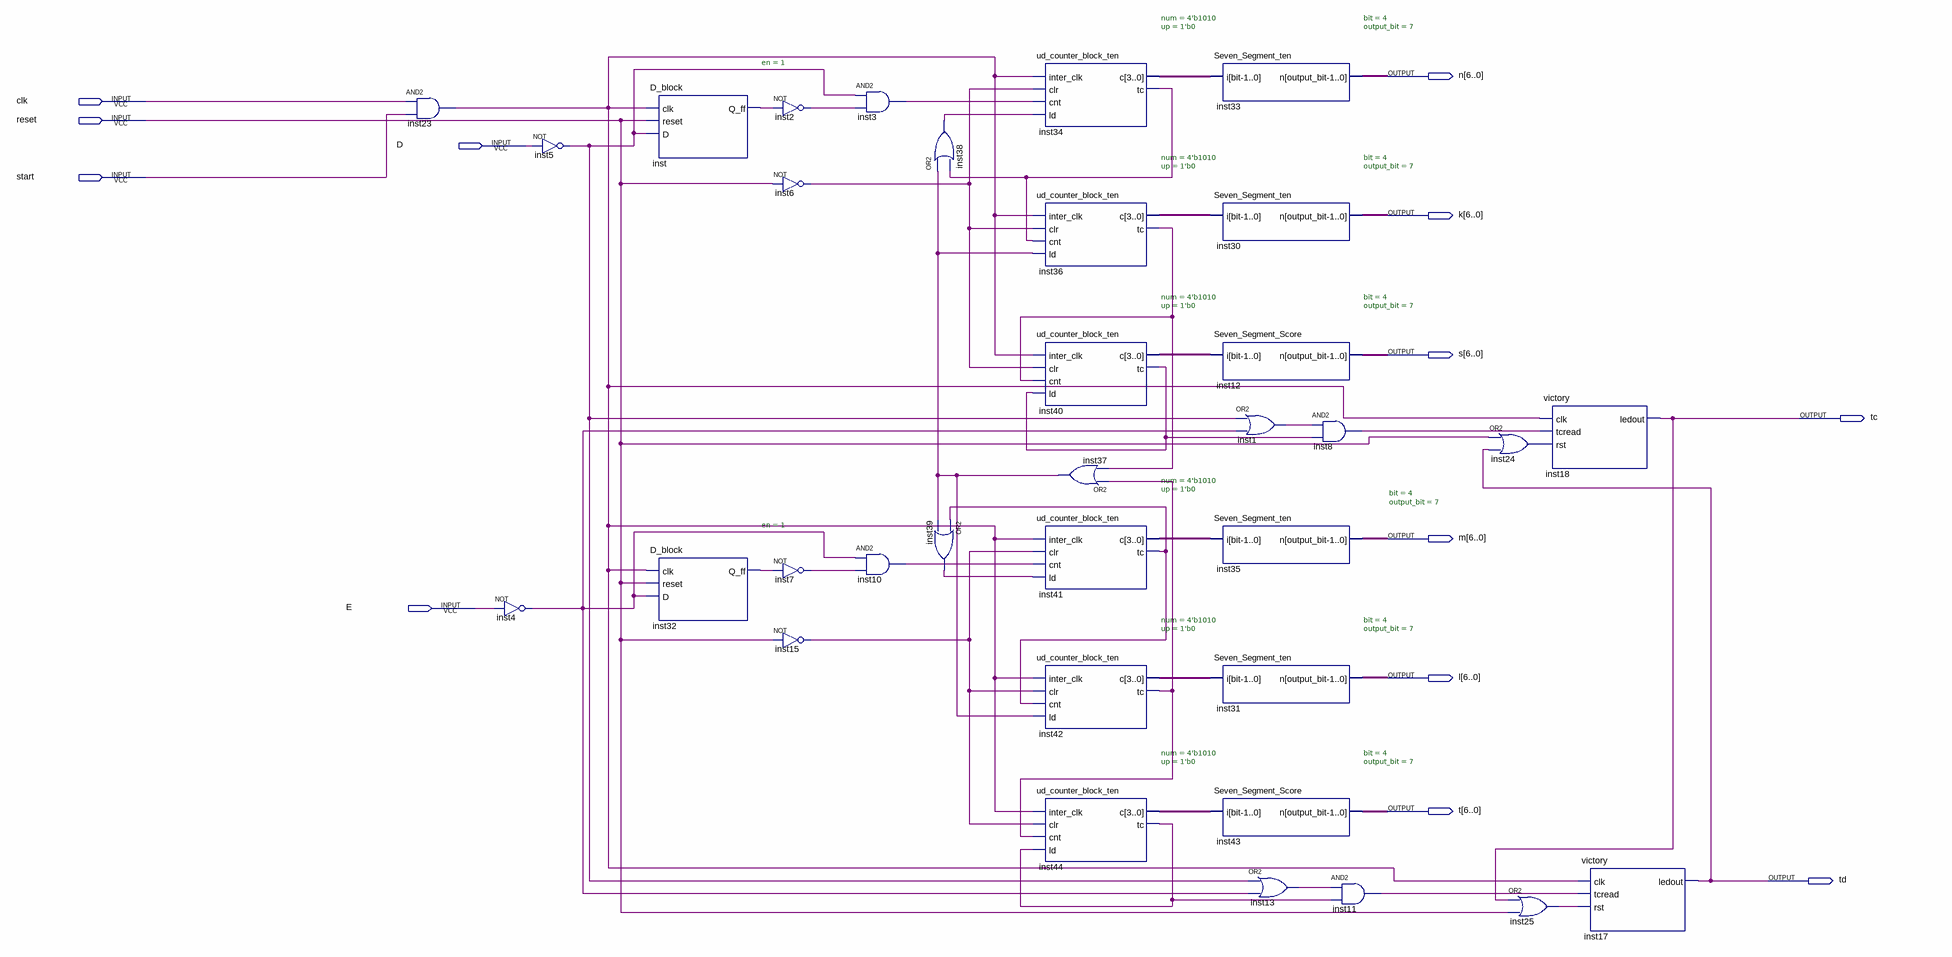
[diagram p0: schematic sheet]
// Quartus schematic lab1.bdf as structural Verilog: 34 symbols, 13 pins
module lab1 (
  input  clk,
  input  reset,
  input  D,
  input  start,
  input  E,
  output [6:0] n,
  output [6:0] k,
  output [6:0] s,
  output tc,
  output [6:0] m,
  output [6:0] l,
  output [6:0] t,
  output td
);

  wire inst1_out, inst2_out, inst3_out, inst4_out, inst5_out, inst6_out, inst7_out, inst8_out, inst10_out,
       inst11_out, inst13_out, inst15_out, inst23_out, inst24_out, inst25_out, inst32_q_ff, inst34_tc,
       inst36_tc, inst37_out, inst38_out, inst39_out, inst40_tc, inst41_tc, inst42_tc, inst44_tc, inst_q_ff;
  wire [3:0] inst34_c, inst36_c, inst40_c, inst41_c, inst42_c, inst44_c;

  and inst23 (inst23_out, clk, start);
  not inst4 (inst4_out, E);
  not inst5 (inst5_out, D);
  D_block #(.en(1)) inst (.clk(inst23_out), .reset(reset), .D(inst5_out), .Q_ff(inst_q_ff));
  D_block #(.en(1)) inst32 (.clk(inst23_out), .reset(reset), .D(inst4_out), .Q_ff(inst32_q_ff));
  not inst2 (inst2_out, inst_q_ff);
  not inst6 (inst6_out, reset);
  not inst7 (inst7_out, inst32_q_ff);
  not inst15 (inst15_out, reset);
  and inst3 (inst3_out, inst5_out, inst2_out);
  and inst10 (inst10_out, inst4_out, inst7_out);
  or inst38 (inst38_out, inst37_out, inst34_tc);
  or inst39 (inst39_out, inst41_tc, inst37_out);
  ud_counter_block_ten #(.num(4'b1010), .up(1'b0)) inst34 (
    .inter_clk(inst23_out), .clr(inst6_out), .cnt(inst3_out), .ld(inst38_out), .c(inst34_c), .tc(inst34_tc));
  ud_counter_block_ten #(.num(4'b1010), .up(1'b0)) inst36 (
    .inter_clk(inst23_out), .clr(inst6_out), .cnt(inst34_tc), .ld(inst37_out), .c(inst36_c), .tc(inst36_tc));
  ud_counter_block_ten #(.num(4'b1010), .up(1'b0)) inst40 (
    .inter_clk(inst23_out), .clr(inst6_out), .cnt(inst36_tc), .ld(inst40_tc), .c(inst40_c), .tc(inst40_tc));
  or inst37 (inst37_out, inst42_tc, inst36_tc);
  ud_counter_block_ten #(.num(4'b1010), .up(1'b0)) inst41 (
    .inter_clk(inst23_out), .clr(inst15_out), .cnt(inst10_out), .ld(inst39_out), .c(inst41_c), .tc(inst41_tc));
  ud_counter_block_ten #(.num(4'b1010), .up(1'b0)) inst42 (
    .inter_clk(inst23_out), .clr(inst15_out), .cnt(inst41_tc), .ld(inst37_out), .c(inst42_c), .tc(inst42_tc));
  ud_counter_block_ten #(.num(4'b1010), .up(1'b0)) inst44 (
    .inter_clk(inst23_out), .clr(inst15_out), .cnt(inst42_tc), .ld(inst44_tc), .c(inst44_c), .tc(inst44_tc));
  Seven_Segment_ten #(.\bit (4), .output_bit(7)) inst33 (.i(inst34_c), .n(n));
  Seven_Segment_ten #(.\bit (4), .output_bit(7)) inst30 (.i(inst36_c), .n(k));
  Seven_Segment_Score #(.\bit (4), .output_bit(7)) inst12 (.i(inst40_c), .n(s));
  Seven_Segment_ten #(.\bit (4), .output_bit(7)) inst35 (.i(inst41_c), .n(m));
  Seven_Segment_ten #(.\bit (4), .output_bit(7)) inst31 (.i(inst42_c), .n(l));
  Seven_Segment_Score #(.\bit (4), .output_bit(7)) inst43 (.i(inst44_c), .n(t));
  or inst1 (inst1_out, inst5_out, inst4_out);
  or inst13 (inst13_out, inst5_out, inst4_out);
  and inst8 (inst8_out, inst1_out, inst40_tc);
  and inst11 (inst11_out, inst13_out, inst44_tc);
  or inst24 (inst24_out, reset, td);
  or inst25 (inst25_out, tc, reset);
  victory inst18 (.clk(inst23_out), .tcread(inst8_out), .rst(inst24_out), .ledout(tc));
  victory inst17 (.clk(inst23_out), .tcread(inst11_out), .rst(inst25_out), .ledout(td));
endmodule
